# Altium schematic sheet CPU_STM32F4.SchDoc: Thermostat 8CH
size 420 x 297 mm; Author: G.K.; CompanyName: WUT; DrawnBy: G.K.; Organization: WUT ISE; Address1: Warsaw Univeristy of Technology; Address2: Nowowiejska 15/19; DocumentNumber: 3; Revision: -; SheetNumber: 3; SheetTotal: 9; EDA_Number: Sinara; Projet: Thermostat; ModifiedBy: -; CreateDate: XX/XX/XXXX; CheckedDate: -; Title2: STM32 CPU; DivGrp: ISE; Designer: G.K.; ModifiedDate: -; ProjectName: Booster RF Power Amplifier
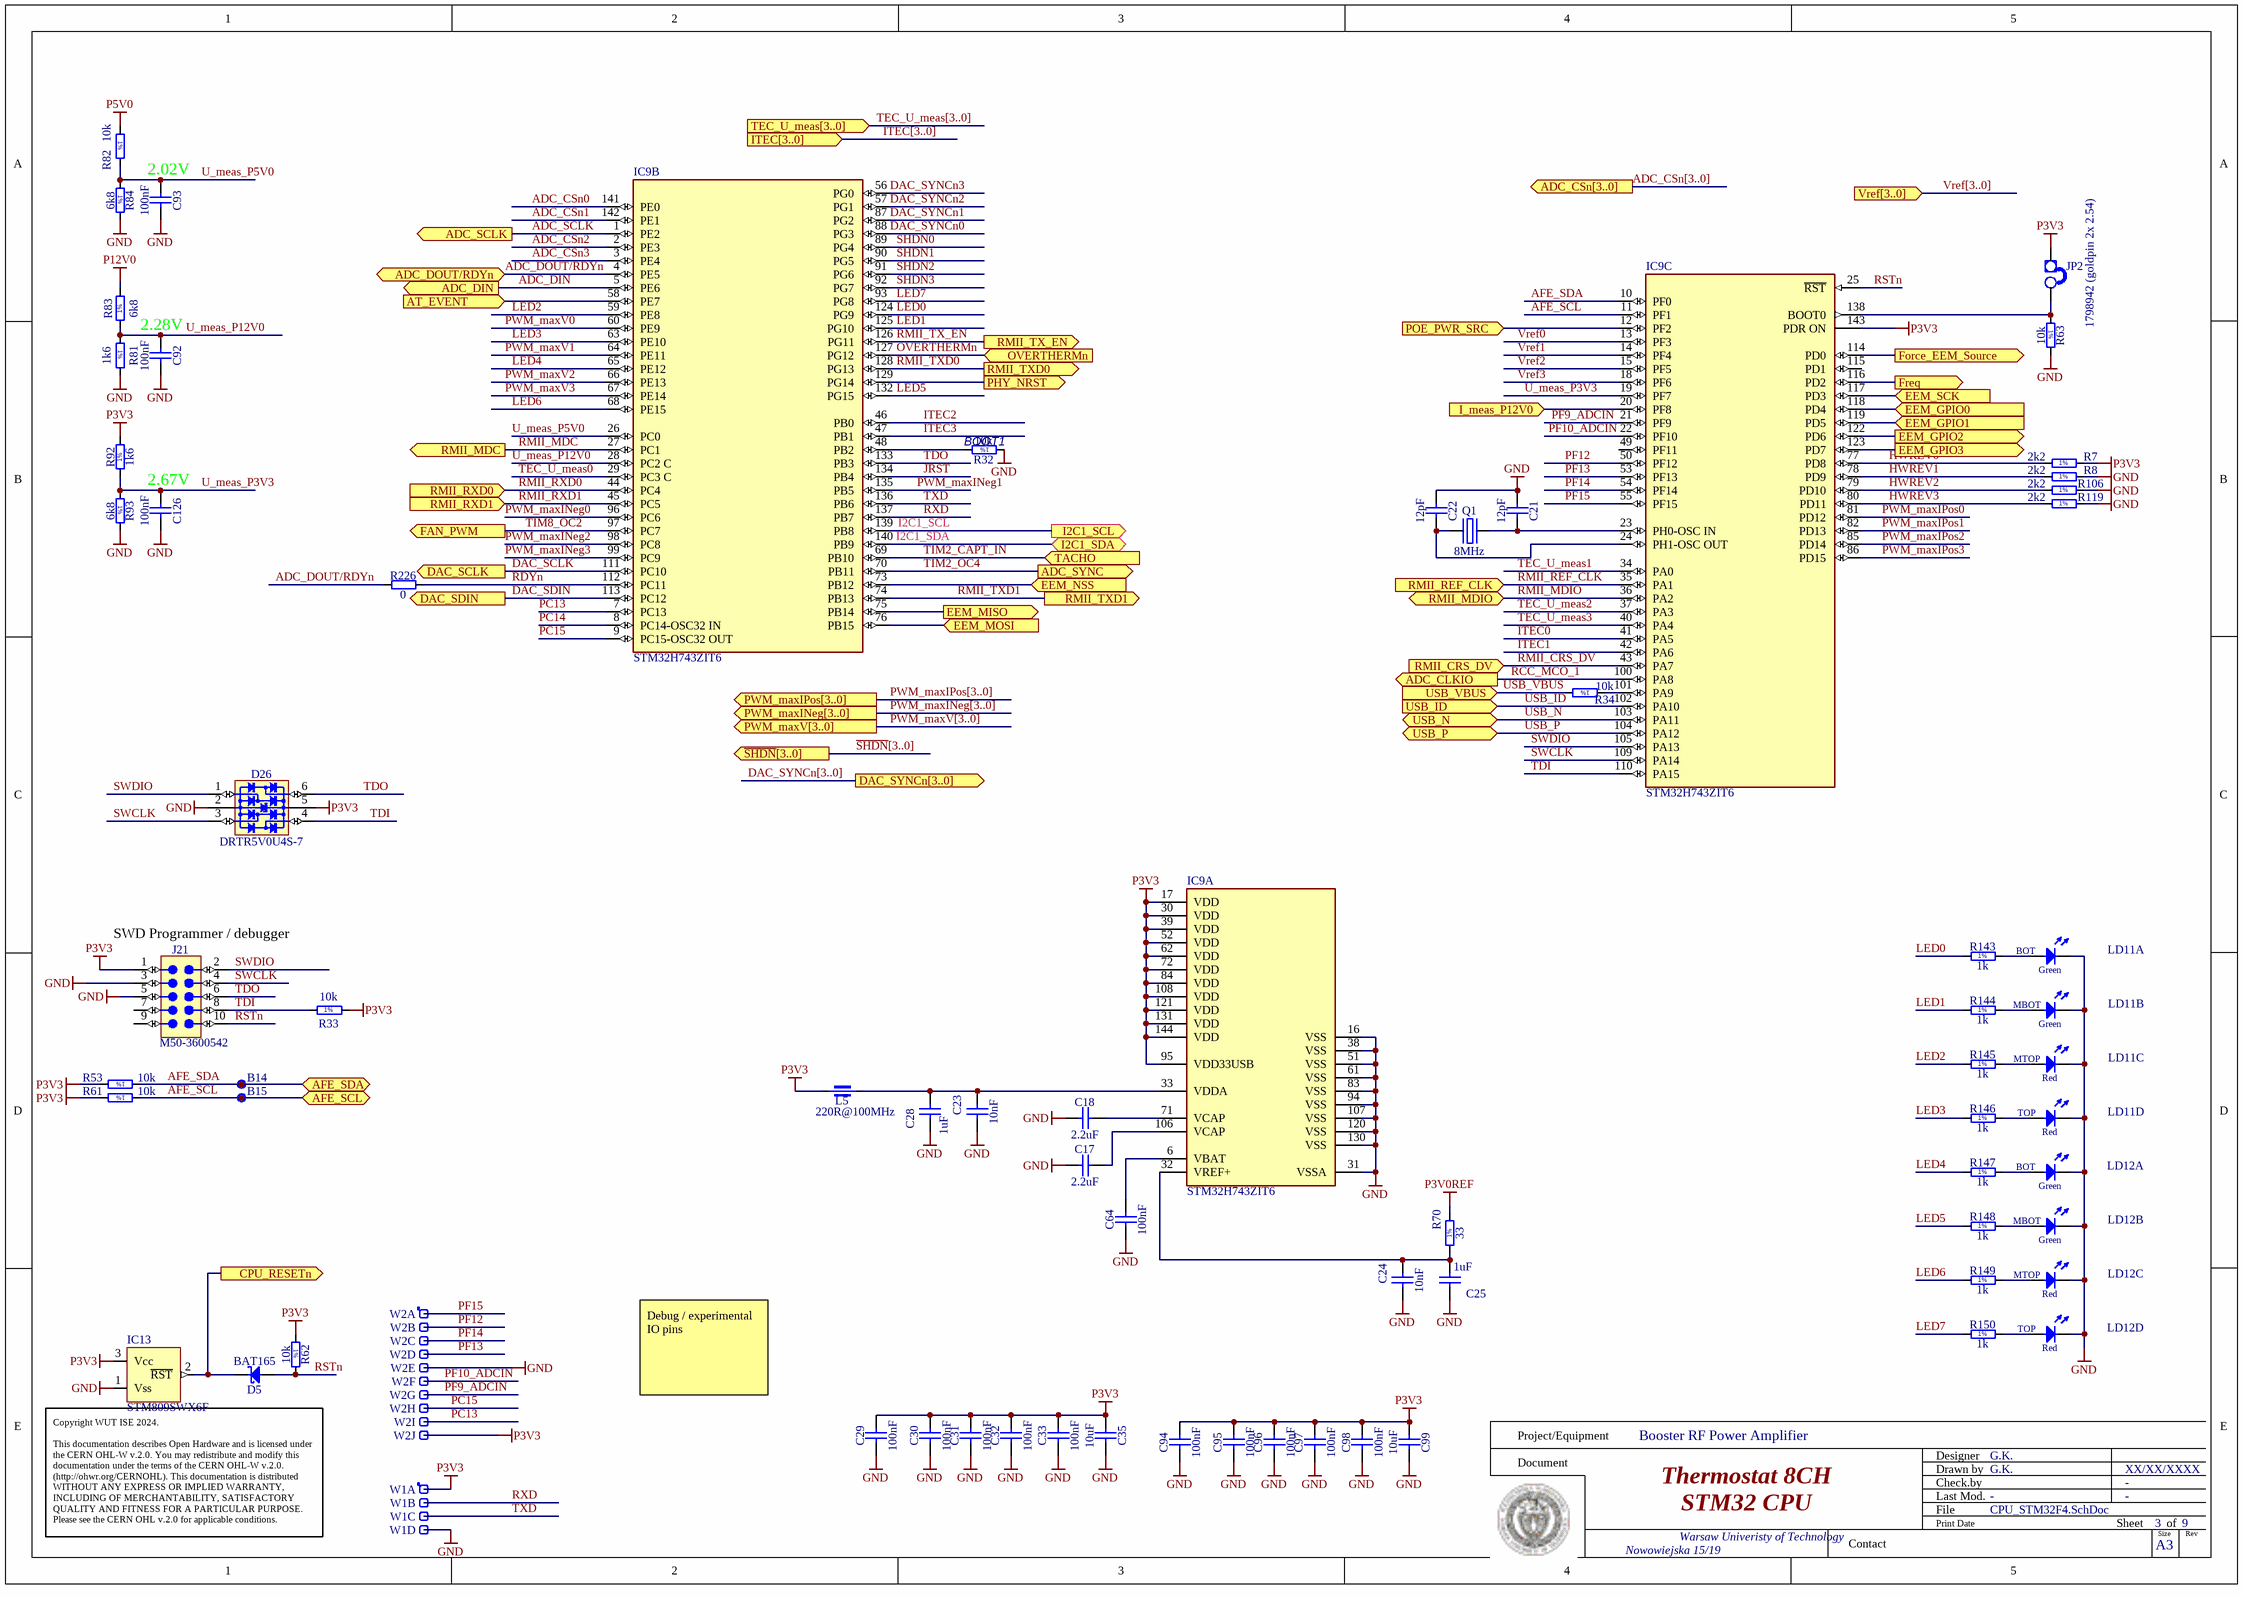
[diagram p0: CPU_STM32F4.SchDoc]

## Parts
B14  SMD Pad  [C100]  (value not drawn)
B15  SMD Pad  [C100]  (value not drawn)
C17  2.2uF  [CAPC1608X90N]
C18  2.2uF  [CAPC1608X90N]
C21  12pF  [CAPC1005X55N]
C22  12pF  [CAPC1005X55N]
C23  10nF  [CAPC1005X55N]
C24  10nF  [CAPC1005X55N]
C25  1uF  [CAPC1608X87N]
C28  1uF  [CAPC1608X87N]
C29  100nF  [CAPC1005X55N]
C30  100nF  [CAPC1005X55N]
C31  100nF  [CAPC1005X55N]
C32  100nF  [CAPC1005X55N]
C33  100nF  [CAPC1005X55N]
C35  10uF  [CAPC2012X135N]
C64  100nF  [CAPC1005X55N]
C92  100nF  [CAPC1005X55N]
C93  100nF  [CAPC1005X55N]
C94  100nF  [CAPC1005X55N]
C95  100nF  [CAPC1005X55N]
C96  100nF  [CAPC1005X55N]
C97  100nF  [CAPC1005X55N]
C98  100nF  [CAPC1005X55N]
C99  10uF  [CAPC2012X135N]
C126  100nF  [CAPC1005X55N]
D5  BAT165  [SOD2512X110N]
D26  DRTR5V0U4S-7  [SOT65P210X110-6N]
IC9  STM32H743ZIT6  [FP-LQFP144-1A-MFG]  (parts A,B,C of 3)
IC13  STM809SWX6F  [SOT-23]
J21  Manufacturer Part Number: M50-3600542  [HARWIN_M50-3600542]  (hidden comment: Header 10)
JP2  1798942 (goldpin 2x 2.54)  [jump]
L5  220R@100MHz  [INDC1005X55N]
LD11  Green/Green/HeRed/HeRed  [LED_BIVAR_H485CHHGGDL]  (value not drawn)  (parts A,B,C,D of 4)
LD12  Green/Green/HeRed/HeRed  [LED_BIVAR_H485CHHGGDL]  (value not drawn)  (parts A,B,C,D of 4)
Q1  8MHz  [XTAL_TXC_7A]
R7  2k2  [RESC1005X40N]
R8  2k2  [RESC1005X40N]
R32  10k  [RESC1005X40N]
R33  10k  [RESC1005X40N]
R34  10k  [RESC1005X40N]
R53  10k  [RESC1005X40N]
R61  10k  [RESC1005X40N]
R62  10k  [RESC1005X40N]
R63  10k  [RESC1005X40N]
R70  33  [RESC1005X40N]
R81  1k6  [RESC1005X40N]
R82  10k  [RESC1005X40N]
R83  6k8  [RESC1005X40N]
R84  6k8  [RESC1005X40N]
R92  1k6  [RESC1005X40N]
R93  6k8  [RESC1005X40N]
R106  2k2  [RESC1005X40N]
R119  2k2  [RESC1005X40N]
R143  1k  [RESC1005X40N]
R144  1k  [RESC1005X40N]
R145  1k  [RESC1005X40N]
R146  1k  [RESC1005X40N]
R147  1k  [RESC1005X40N]
R148  1k  [RESC1005X40N]
R149  1k  [RESC1005X40N]
R150  1k  [RESC1005X40N]
R226  0  [RESC1005X40N]
W1  Header 4  [SAMTEC_HTSW-104-23-L-S]  (value not drawn)  (parts A,B,C,D of 4)
W2  Header 10  [SAMTEC_MTLW-110-07-L-S-250]  (value not drawn)  (parts A,B,C,D,E,F,G,H,I,J of 10)

## Ports
ADC_CLKIO (out), ADC_CSn[3..0] (out), ADC_DIN (out), ADC_DOUT/RDYn (bidir), ADC_SCLK (out), ADC_SYNC (out), AFE_SCL (bidir), AFE_SDA (bidir), AT_EVENT (in), CPU_RESETn (out), DAC_SCLK (out), DAC_SDIN (out), DAC_SYNCn[3..0] (out), EEM_GPIO0 (in), EEM_GPIO1 (in), EEM_GPIO2 (out), EEM_GPIO3 (out), EEM_MISO (out), EEM_MOSI (in), EEM_NSS (in), EEM_SCK (in), FAN_PWM (out), Force_EEM_Source (out), Freq (out), I2C1_SCL (out), I2C1_SDA (bidir), I_meas_P12V0 (in), ITEC[3..0] (in), OVERTHERMn (in), PHY_NRST (out), POE_PWR_SRC (in), PWM_maxINeg[3..0] (out), PWM_maxIPos[3..0] (out), PWM_maxV[3..0] (out), RMII_CRS_DV (in), RMII_MDC (out), RMII_MDIO (bidir), RMII_REF_CLK (in), RMII_RXD0 (in), RMII_RXD1 (in), RMII_TX_EN (out), RMII_TXD0 (out), RMII_TXD1 (out), TACHO (in), TEC_U_meas[3..0] (in), USB_ID (in), USB_N (bidir), USB_P (bidir), USB_VBUS (in), Vref[3..0] (in), ~{SHDN}[3..0] (out)

## Nets
GND: C17.1 C18.1 C21.2 C22.2 C23.1 C24.1 C25.1 C28.1 C29.1 C30.1 C31.1 C32.1 C33.1 C35.2 C64.1 C92.2 C93.2 C94.1 C95.1 C96.1 C97.1 C98.1 C99.2 C126.2 D26.2(GND) IC9.16(VSS) IC9.31(VSSA) IC9.38(VSS) IC9.51(VSS) IC9.61(VSS) IC9.83(VSS) IC9.94(VSS) IC9.107(VSS) IC9.120(VSS) IC9.130(VSS) IC13.1(Vss) J21.3 J21.5 LD11.1(C) LD11.3(C) LD11.5(C) LD11.7(C) LD12.1(C) LD12.3(C) LD12.5(C) LD12.7(C) R8.2 R32.1 R63.2 R81.2 R84.2 R93.2 R106.2 R119.2 W1.4 W2.5
P3V0REF: R70.2
P3V3: C29.2 C30.2 C31.2 C32.2 C33.2 C35.1 C94.2 C95.2 C96.2 C97.2 C98.2 C99.1 D26.5(VBUS) IC9.17(VDD) IC9.30(VDD) IC9.39(VDD) IC9.52(VDD) IC9.62(VDD) IC9.72(VDD) IC9.84(VDD) IC9.95(VDD33USB) IC9.108(VDD) IC9.121(VDD) IC9.131(VDD) IC9.143(PDR_ON) IC9.144(VDD) IC13.3(Vcc) J21.1 JP2.1(E1) L5.2 R7.2 R33.2 R53.2 R61.2 R62.1 R92.2 W1.1 W2.10
P5V0: R82.1
P12V0: R83.2
~{SHDN}0: IC9.89(PG4)
~{SHDN}1: IC9.90(PG5)
~{SHDN}2: IC9.91(PG6)
~{SHDN}3: IC9.92(PG7)
ADC_CSn0: IC9.141(PE0)
ADC_CSn1: IC9.142(PE1)
ADC_CSn2: IC9.2(PE3)
ADC_CSn3: IC9.3(PE4)
ADC_DIN: IC9.5(PE6) ; port ADC_DIN
ADC_DOUT/RDYn: IC9.4(PE5) R226.1 ; port ADC_DOUT/RDYn
ADC_SCLK: IC9.1(PE2) ; port ADC_SCLK
AFE_SCL: B15.1 IC9.11(PF1) R61.1 ; port AFE_SCL
AFE_SDA: B14.1 IC9.10(PF0) R53.1 ; port AFE_SDA
AT_EVENT: IC9.58(PE7) ; port AT_EVENT
CPU_RESETn: D5.1(C) IC13.2(~{RST}) ; port CPU_RESETn
DAC_SCLK: IC9.111(PC10) ; port DAC_SCLK
DAC_SDIN: IC9.113(PC12) ; port DAC_SDIN
DAC_SYNCn0: IC9.88(PG3)
DAC_SYNCn1: IC9.87(PG2)
DAC_SYNCn2: IC9.57(PG1)
DAC_SYNCn3: IC9.56(PG0)
EEM_GPIO0: IC9.118(PD4) ; port EEM_GPIO0
EEM_GPIO1: IC9.119(PD5) ; port EEM_GPIO1
EEM_GPIO2: IC9.122(PD6) ; port EEM_GPIO2
EEM_GPIO3: IC9.123(PD7) ; port EEM_GPIO3
EEM_MISO: IC9.75(PB14) ; port EEM_MISO
EEM_MOSI: IC9.76(PB15) ; port EEM_MOSI
EEM_NSS: IC9.73(PB12) ; port EEM_NSS
EEM_SCK: IC9.117(PD3) ; port EEM_SCK
Force_EEM_Source: IC9.114(PD0) ; port Force_EEM_Source
Freq: IC9.116(PD2) ; port Freq
HWREV0: IC9.77(PD8) R7.1
HWREV1: IC9.78(PD9) R8.1
HWREV2: IC9.79(PD10) R106.1
HWREV3: IC9.80(PD11) R119.1
I2C1_SCL: IC9.139(PB8) ; port I2C1_SCL
I2C1_SDA: IC9.140(PB9) ; port I2C1_SDA
I_meas_P12V0: IC9.20(PF8) ; port I_meas_P12V0
ITEC0: IC9.41(PA5)
ITEC1: IC9.42(PA6)
ITEC2: IC9.46(PB0)
ITEC3: IC9.47(PB1)
JRST: IC9.134(PB4)
LED0: IC9.124(PG9) R143.1
LED1: IC9.125(PG10) R144.1
LED2: IC9.59(PE8) R145.1
LED3: IC9.63(PE10) R146.1
LED4: IC9.65(PE12) R147.1
LED5: IC9.132(PG15) R148.1
LED6: IC9.68(PE15) R149.1
LED7: IC9.93(PG8) R150.1
OVERTHERMn: IC9.127(PG12) ; port OVERTHERMn
PC13: IC9.7(PC13) W2.9
PC14: IC9.8(PC14-OSC32_IN)
PC15: IC9.9(PC15-OSC32_OUT) W2.8
PF9_ADCIN: IC9.21(PF9) W2.7
PF10_ADCIN: IC9.22(PF10) W2.6
PF12: IC9.50(PF12) W2.2
PF13: IC9.53(PF13) W2.4
PF14: IC9.54(PF14) W2.3
PF15: IC9.55(PF15) W2.1
PHY_NRST: IC9.129(PG14) ; port PHY_NRST
POE_PWR_SRC: IC9.12(PF2) ; port POE_PWR_SRC
PWM_maxINeg0: IC9.96(PC6)
PWM_maxINeg1: IC9.135(PB5)
PWM_maxINeg2: IC9.98(PC8)
PWM_maxINeg3: IC9.99(PC9)
PWM_maxIPos0: IC9.81(PD12)
PWM_maxIPos1: IC9.82(PD13)
PWM_maxIPos2: IC9.85(PD14)
PWM_maxIPos3: IC9.86(PD15)
PWM_maxV0: IC9.60(PE9)
PWM_maxV1: IC9.64(PE11)
PWM_maxV2: IC9.66(PE13)
PWM_maxV3: IC9.67(PE14)
RCC_MCO_1: IC9.100(PA8) ; port ADC_CLKIO
RDYn: IC9.112(PC11) R226.2
RMII_CRS_DV: IC9.43(PA7) ; port RMII_CRS_DV
RMII_MDC: IC9.27(PC1) ; port RMII_MDC
RMII_MDIO: IC9.36(PA2) ; port RMII_MDIO
RMII_REF_CLK: IC9.35(PA1) ; port RMII_REF_CLK
RMII_RXD0: IC9.44(PC4) ; port RMII_RXD0
RMII_RXD1: IC9.45(PC5) ; port RMII_RXD1
RMII_TX_EN: IC9.126(PG11) ; port RMII_TX_EN
RMII_TXD0: IC9.128(PG13) ; port RMII_TXD0
RMII_TXD1: IC9.74(PB13) ; port RMII_TXD1
RSTn: D5.2(A) IC9.25(~{RST}) J21.10 R62.2
RXD: IC9.137(PB7) W1.2
SWCLK: D26.3(I/O2) IC9.109(PA14) J21.4
SWDIO: D26.1(I/O1) IC9.105(PA13) J21.2
TDI: D26.4(I/O3) IC9.110(PA15) J21.8 R33.1
TDO: D26.6(I/O4) IC9.133(PB3) J21.6
TEC_U_meas0: IC9.29(PC3_C)
TEC_U_meas1: IC9.34(PA0)
TEC_U_meas2: IC9.37(PA3)
TEC_U_meas3: IC9.40(PA4)
TIM2_CAPT_IN: IC9.69(PB10) ; port TACHO
TIM2_OC4: IC9.70(PB11) ; port ADC_SYNC
TIM8_OC2: IC9.97(PC7) ; port FAN_PWM
TXD: IC9.136(PB6) W1.3
U_meas_P3V3: C126.1 IC9.19(PF7) R92.1 R93.1
U_meas_P5V0: C93.1 IC9.26(PC0) R82.2 R84.1
U_meas_P12V0: C92.1 IC9.28(PC2_C) R81.1 R83.1
USB_ID: IC9.102(PA10) ; port USB_ID
USB_N: IC9.103(PA11) ; port USB_N
USB_P: IC9.104(PA12) ; port USB_P
USB_VBUS: R34.2 ; port USB_VBUS
Vref0: IC9.13(PF3)
Vref1: IC9.14(PF4)
Vref2: IC9.15(PF5)
Vref3: IC9.18(PF6)
NetC17_2: C17.2 IC9.106(VCAP)
NetC18_2: C18.2 IC9.71(VCAP)
NetC21_1: C21.1 IC9.23(PH0-OSC_IN) Q1.1(OSC1)
NetC22_1: C22.1 IC9.24(PH1-OSC_OUT) Q1.2(OSC2)
NetC23_2: C23.2 C28.2 IC9.33(VDDA) L5.1
NetC24_2: C24.2 C25.2 IC9.32(VREF+) R70.1
NetC64_2: C64.2 IC9.6(VBAT)
NetIC9_48: IC9.48(PB2) R32.2
NetIC9_101: IC9.101(PA9) R34.1
NetIC9_138: IC9.138(BOOT0) JP2.2(E2) R63.1
NetLD11_2: LD11.2(A) R143.2
NetLD11_4: LD11.4(A) R144.2
NetLD11_6: LD11.6(A) R145.2
NetLD11_8: LD11.8(A) R146.2
NetLD12_2: LD12.2(A) R147.2
NetLD12_4: LD12.4(A) R148.2
NetLD12_6: LD12.6(A) R149.2
NetLD12_8: LD12.8(A) R150.2

Not connected (* = marked no-connect by the designer): IC9 49(PF11) 115(PD1); J21 7 9

## Buses and harness runs
bus ADC_CSn[3..0] = port ADC_CSn[3..0]
bus DAC_SYNCn[3..0] = port DAC_SYNCn[3..0]
bus ITEC[3..0] = port ITEC[3..0]
bus PWM_maxINeg[3..0] = port PWM_maxINeg[3..0]
bus PWM_maxIPos[3..0] = port PWM_maxIPos[3..0]
bus PWM_maxV[3..0] = port PWM_maxV[3..0]
bus TEC_U_meas[3..0] = port TEC_U_meas[3..0]
bus Vref[3..0] = port Vref[3..0]
bus ~{SHDN}[3..0] = port ~{SHDN}[3..0]

## Notes on the sheet
- (near C93) 2.02V
- 2.28V
- (near R32) BOOT1
- (near C126) 2.67V
- (near J21) SWD Programmer / debugger
- Debug / experimental IO pins
- Project/Equipment
- Document
- Designer
- Drawn by
- Check.by
- Copyright WUT ISE 2024.
  This documentation describes Open Hardware and is licensed under the CERN OHL-W v.2.0. You may redistribute and modify this documentation under the terms of the CERN OHL-W v.2.0. (http://ohwr.org/CERNOHL). This documentation is distributed WITHOUT ANY EXPRESS OR IMPLIED WARRANTY, INCLUDING OF MERCHANTABILITY, SATISFACTORY QUALITY AND FITNESS FOR A PARTICULAR PURPOSE. Please see the CERN OHL v.2.0 for applicable conditions.
- Contact
- File
- Last Mod.
- Print Date
- Sheet
- Size
- A3
- of
- Rev
- (in symbol LED_BIVAR_H485CHHGGDL, part A) BOT; Green
- (in symbol LED_BIVAR_H485CHHGGDL, part B) MBOT; Green
- (in symbol LED_BIVAR_H485CHHGGDL, part C) MTOP; Red
- (in symbol LED_BIVAR_H485CHHGGDL, part D) TOP; Red
- (in symbol R0402_1K6_1%_0.0625W_100PPM) 1%
- (in symbol R0402_1K_1%_0.0625W_100PPM) 1%
- (in symbol R0402_2K2_1%_0.0625W_100PPM) 1%
- (in symbol R0402_6K8_1%_0.0625W_100PPM) 1%
- (in symbol R0402_10K_1%_0.0625W_100PPM) 1%
- (in symbol R0402_33R_1%_0.0625W_100PPM) 1%

## Library data of the parts
B14 B15 = SMD_PAD_D1MM: Through Hole Pad; Part Description: 1mm Diameter SMD Pad; Mounted: No; Part Number: SMD_PAD_D1MM; Component Kind: Standard (No BOM); Component Type: Standard (No BOM); Pin Count: 1; Family: SMD Pad; Socket: No; SMD: No; Sense: No; Status: None; ComponentHeight: 0mm; HelpURL: Undefined; Author: CERN DEM JLC; CreateDate: 10.10.2017; LatestRevisionDate: 10.10.2017; PackageDescription: 1mm Diameter SMD Pad
C17 C18 = CC0603_2.2UF_10V_20%_X7R: Non-polarised capacitor; Part Description: SMD Multilayer Chip Ceramic Capacitor; Manufacturer: GENERIC; Manufacturer1 Part Number: LMK107B7225MA-T; Voltage: 10V; TC: X7R; Tolerance: ±20%; Part Number: CC0603_2.2UF_10V_20%_X7R; Component Kind: Standard; Component Type: Standard; Pin Count: 2; Value: 2.2uF; Status: Not Recommended; Manufacturer Part Number: CC0603_2.2UF_10V_20%_X7R; Case: 0603; Mounted: Yes; Socket: No; SMD: Yes; Sense: No; Manufacturer1 Example: TAIYO YUDEN; Manufacturer1 ComponentHeight: 0.9mm; HelpURL: \\cern.ch\dfs\Applications\Altium\Datasheets\CC0603_X7R_TAIYO-YUDEN_HIGH-VALUE.pdf; Author: CERN DEM JLC; CreateDate: 22.06.2011; LatestRevisionDate: 27.06.2011
C21 C22 = CC0402_12PF_50V_5%_C0G: Non-polarised capacitor; Part Description: SMD Multilayer Chip Ceramic Capacitor; Manufacturer: GENERIC; Manufacturer1 Part Number: C0402C120J5GACTU; Voltage: 50V; TC: C0G/NP0; Tolerance: ±5%; Part Number: CC0402_12PF_50V_5%_C0G; Component Kind: Standard; Component Type: Standard; Pin Count: 2; Value: 12pF; Status: Preferred; Manufacturer Part Number: CC0402_12PF_50V_5%_C0G; Case: 0402; Mounted: Yes; Socket: No; SMD: Yes; Sense: No; Manufacturer1 Example: KEMET; Manufacturer1 ComponentHeight: 0.55mm; HelpURL: \\cern.ch\dfs\Applications\Altium\Datasheets\CC0805_C0G_KEMET_(Commercial Grade).pdf; Author: CERN DEM JLC; CreateDate: 04.10.2016; LatestRevisionDate: 04.10.2016
C23 C24 = CC0402_10NF_25V_10%_X7R: Non-polarised capacitor; Part Description: SMD Multilayer Chip Ceramic Capacitor; Manufacturer: GENERIC; Manufacturer1 Part Number: C1005X7R1E103KT; Voltage: 25V; TC: X7R; Tolerance: ±10%; Part Number: CC0402_10NF_25V_10%_X7R; Component Kind: Standard; Component Type: Standard; Pin Count: 2; Value: 10nF; Status: Preferred; Manufacturer Part Number: CC0402_10NF_25V_10%_X7R; Case: 0402; Mounted: Yes; Socket: No; SMD: Yes; Sense: No; Manufacturer1 Example: TDK; Manufacturer1 ComponentHeight: 0.55mm; HelpURL: \\cern.ch\dfs\Applications\Altium\Datasheets\CC0402_X7R_TDK_C.pdf; Author: CERN DEM JLC; CreateDate: 25/10/2012; LatestRevisionDate: 25/10/2012
C25 C28 = CC0603_1UF_25V_10%_X7R: Non-polarised capacitor; Part Description: SMD Multilayer Chip Ceramic Capacitor; Manufacturer: GENERIC; Manufacturer1 Part Number: GRM188R71E105KA12D; Voltage: 25V; TC: X7R; Tolerance: ±10%; Part Number: CC0603_1UF_25V_10%_X7R; Component Kind: Standard; Component Type: Standard; Pin Count: 2; Value: 1uF; Status: None; Manufacturer Part Number: CC0603_1UF_25V_10%_X7R; Case: 0603; Mounted: Yes; Socket: No; SMD: Yes; Sense: No; Manufacturer1 Example: MURATA; Manufacturer1 ComponentHeight: 0.9mm; HelpURL: \\cern.ch\dfs\Applications\Altium\Datasheets\CC0603_X7R_MURATA.pdf; Author: CERN DEM JLC; CreateDate: 18/01/2011; LatestRevisionDate: 18/01/2011
C29-C33 C64 C94-C98 = CC0402_100NF_16V_10%_X5R: Non-polarised capacitor; Part Description: SMD Multilayer Chip Ceramic Capacitor; Manufacturer: GENERIC; Manufacturer1 Part Number: GRM155R61C104KA88D; Voltage: 16V; TC: X5R; Tolerance: ±10%; Part Number: CC0402_100NF_16V_10%_X5R; Component Kind: Standard; Component Type: Standard; Pin Count: 2; Value: 100nF; Status: None; Manufacturer Part Number: CC0402_100NF_16V_10%_X5R; Case: 0402; Mounted: Yes; Socket: No; SMD: Yes; Sense: No; Manufacturer1 Example: MURATA; Manufacturer1 ComponentHeight: 0.55mm; HelpURL: \\cern.ch\dfs\Applications\Altium\Datasheets\CC0402_X5R_MURATA_GRM.pdf; Author: CERN DEM JLC; CreateDate: 10.12.2013; LatestRevisionDate: 10.12.2013
C35 C99 = CC0805_10UF_16V_10%_X5R: Non-polarised capacitor; Part Description: SMD Multilayer Chip Ceramic Capacitor; Manufacturer: GENERIC; Manufacturer1 Part Number: C0805C106K4PAC; Voltage: 16V; TC: X5R; Tolerance: ±10%; Part Number: CC0805_10UF_16V_10%_X5R; Component Kind: Standard; Component Type: Standard; Pin Count: 2; Value: 10uF; Status: Preferred; Manufacturer Part Number: CC0805_10UF_16V_10%_X5R; Case: 0805; Mounted: Yes; Socket: No; SMD: Yes; Manufacturer1 Example: KEMET; Manufacturer1 ComponentHeight: 1.4mm; HelpURL: \\cern.ch\dfs\Applications\Altium\Datasheets\CC1206_X5R_KEMET.pdf; Author: CERN DEM JLC; CreateDate: 03.12.2007; LatestRevisionDate: 03.12.2007; Sense: No
C92 C93 C126 = CC0402_100NF_16V_10%_X5R: Non-polarised capacitor; Part Description: SMD Multilayer Chip Ceramic Capacitor; Manufacturer: GENERIC; Manufacturer1 Part Number: GRM155R61C104KA88D; Voltage: 16V; TC: X5R; Tolerance: ±10%; Table: Capacitors SMD; Part Number: CC0402_100NF_16V_10%_X5R; Component Kind: Standard; Component Type: Standard; Pin Count: 2; Value: 100nF; Status: None; Manufacturer Part Number: CC0402_100NF_16V_10%_X5R; Case: 0402; Mounted: Yes; Socket: No; SMD: Yes; Manufacturer1 Example: MURATA; Manufacturer1 ComponentHeight: 0.55mm; HelpURL: \\cern.ch\dfs\Applications\Altium\Datasheets\CC0402_X5R_MURATA_GRM.pdf; Author: CERN DEM JLC; CreateDate: 2013-12-10; LatestRevisionDate: 2013-12-10
D5 = BAT165: Schottky Diode; Part Description: Medium Power AF Schottky Diode; Manufacturer: INFINEON; Voltage: 40V; Power: 750mA; PressFit: No; Bonding: No; Part Number: BAT165; Component Kind: Standard; Component Type: Standard; Device: BAT165; PackageDescription: Small Outline Diode Flat Lead (SOD-323), 1.70mm W X 1.25mm L X 1.10mm H body,  IPC Medium Density; Manufacturer Part Number: BAT165; Pin Count: 2; Case: SOD323; Mounted: Yes; Socket: No; SMD: Yes; Sense: No; ComponentHeight: 1.1mm; HelpURL: \\cern.ch\dfs\Applications\Altium\Datasheets\BAT165.pdf; Author: CERN DEM JLC; CreateDate: 12.11.2014; LatestRevisionDate: 12.11.2014
D26 = D_TVS_DRTR5V0U4S-7: Integrated Quad Ultra-Low Capacitance ESD Protection; Part Description: Integrated Quad Ultra-Low Capacitance ESD (±8kV) Protection; Manufacturer: DIODES; PressFit: No; Bonding: No; Status Comment: Active; Part Number: DRTR5V0U4S-7; Component Kind: Standard; Component Type: Standard; Device: DRTR5V0U4S-7; PackageDescription: SOT363, SC70-6, 0.65mm Pitch; 6 Pin, 1.25mm W X 2.00mm L X 1.10mm H body, IPC Medium Density; Status: Active; Manufacturer Part Number: DRTR5V0U4S-7; Pin Count: 6; Case: SOT363; Mounted: Yes; Socket: No; SMD: Yes; Sense: No; ComponentHeight: 1.1mm; HelpURL: \\cern.ch\dfs\Applications\Altium\Datasheets\PRTR5V0U4Y.pdf; Author: GK; CreateDate: 24.01.2017; LatestRevisionDate: 14.09.2020
IC9 = CMP-12105-000003-1: IC MCU 32BIT 2MB FLASH 144LQFP; Manufacturer: STMicroelectronics; Number Of I2C Channels: 4; Number Of A/D Converters: 2; Standoff Height: 0.05mm; Interface: I2C,SPI,UART,USART,EBI/EMI,CAN,USB,LIN,IrDA,Other; Max Supply Voltage: 3.6V; Number Of Adc Channels: 36; Ram Size: 1MBytes; Number Of Cores: 1; Frequency: 400MHz; Data Bus Width: 32bits; Core Architecture: ARM Cortex-M7; Memory Size: 2MBytes; Number Of Timers/Counters: 22; Min Supply Voltage: 1.62V; Number Of Spi Channels: 6; Max Junction Temp: +125°C; Number Of I/Os: 114; Digikey Description: IC MCU 32BIT 2MB FLASH 144LQFP; Device Class L2: Embedded Processors and Controllers; Number Of Usb Channels: 2; ComponentLink2Description: Datasheet; Ipc Land Pattern Name: QFP50P2200X2200X160-144; Category: IC; Lead Free: Yes; Temperature Range High: +85°C; Mouser Description: MCU 32-Bit STM32 ARM Cortex M7 RISC 2MB Flash 1.8V/2.5V/3.3V 144-Pin LQFP Tray; RoHS: TRUE; Ambient Temperature Range Low: -40°C; Temperature Range Low: -40°C; ComponentLink2URL: https://www.st.com/resource/en/datasheet/stm32h743zi.pdf; Ambient Temperature Range High: +85°C; Octopart: https://octopart.com/stm32h743zit6-stmicroelectronics-76372529; Number Of Pwm Channels: 2; Height: 1.6mm; Manufacturer Part Number: STM32H743ZIT6; Device Class L3: Microcontrollers; Device Class L1: Integrated Circuits (ICs); Automotive: No; Memory Type: FLASH; Number Of Uart Channels: 4; Package: LQFP144-1A; Temperature: -40°C to +85°C
IC13 = VMON_STM809: 2.93V  Reset circuit; Manufacturer Part Number: STM809SWX6F
J21 = CON_2x10 1.27 SMT_male_HARWIN: 10 Contacts - Pitch 1.27mm - Dual Row SMT Vertical Pin Header (Post Lead = 3mm, Insulator 1mm); Manufacturer: HARWIN; PressFit: No; Part Number: HARWIN_M50-3600542; Component Kind: Standard; Component Type: Standard; Pin Count: 10; Family: Header 10; Mounted: Yes; Socket: No; SMD: Yes; Sense: No; Status: None; Part Description: 10 Contacts - Pitch 1.27mm - Dual Row SMT Vertical Pin Header (Post Lead = 3mm, Insulator 1mm); ComponentHeight: 5.13mm; HelpURL: \\cern.ch\dfs\Applications\Altium\Datasheets\HARWIN_M50-3600842.pdf; Author: GK; CreateDate: 15.03.2017; LatestRevisionDate: 22.05.2017
JP2 = JUMPER: Manufacturer Part Number: 68001-102HLF; Supplier 1: Farnell; Supplier Part Number 1: 1798942
L5 = IND0402_MURATA_BLM15HB221SN1: Part Description: SMD EMIFIL Suppression Chip Ferrite Bead; Manufacturer: MURATA; Power: 250mA; Resistance: 1R; Tolerance: ±25%; Part Number: IND0402_MURATA_BLM15HB221SN1; Component Kind: Standard; Component Type: Standard; Pin Count: 2; Value: 220R@100MHz; Status: None; Manufacturer Part Number: BLM15HB221SN1; Case: 0402; Mounted: Yes; Socket: No; SMD: Yes; Sense: No; ComponentHeight: 0.55mm; HelpURL: \\cern.ch\dfs\Applications\Altium\Datasheets\IND0402_MURATA_BLM15H.pdf; Author: CERN DEM JLC; CreateDate: 23.06.2009; LatestRevisionDate: 25.10.2018
LD11 LD12 = LED_BIVAR_H485CHHGGDL: LED x4 G-1C2A-BOT_G-3C4A_H-5C6A_H-7C8A-TOP; Part Description: Quad-Level 2mm (Green+Green+HeRed+HeRed) LED, PCB Edge Mounting; Manufacturer: BIVAR; PressFit: No; Bonding: No; Part Number: LED_BIVAR_H485CHHGGDL; Component Kind: Standard; Component Type: Standard; Color: Green/Green/HeRed/HeRed; PackageDescription: Quad-Level 2mm (Green+Green+HeRed+HeRed) LED, PCB Edge Mounting  BIVAR H485C Serie; Status: Not Recommended; Manufacturer Part Number: H485CHHGGDL; Pin Count: 8; Mounted: Yes; Socket: No; SMD: No; Sense: No; ComponentHeight: 11.3mm; HelpURL: \\cern.ch\dfs\Applications\Altium\Datasheets\LED_BIVAR_H485C.pdf; Author: CERN DEM BC; CreateDate: 12.11.2015; LatestRevisionDate: 12.11.2015
Q1 = XTAL_8MHZ_TXC_7A-8.000MAAE-T: Quartz Crystal; Part Description: Tolerance: ±30ppm, Stability: ±30ppm, -20°C to +70°C, 12pF, SMD Glass Seam Sealing Crystal, 7A Series; Manufacturer: TXC CORPORATION; PressFit: No; Bonding: No; Part Number: XTAL_8MHZ_TXC_7A-8.000MAAE-T; Component Kind: Standard; Component Type: Standard; PackageDescription: 2 Pins, 3.2x5mm, SMD Glass Seam Sealing Crystal, 7A Serie; Value: 8MHz; Manufacturer Part Number: 7A-8.000MAAE-T; Pin Count: 2; Mounted: Yes; Socket: No; SMD: Yes; Sense: No; ComponentHeight: 1.2mm; HelpURL: \\cern.ch\dfs\Applications\Altium\Datasheets\XTAL_TXC_7A.pdf; Author: CERN DEM JLC; CreateDate: 09.10.2014; LatestRevisionDate: 12.11.2014
R7 R8 R106 R119 = R0402_2K2_1%_0.0625W_100PPM: Resistor - 1%; Part Description: General Purpose Thick Film Chip Resistor; Manufacturer: GENERIC; Manufacturer1 Part Number: 232270672202L; TC: ±100ppm/°C; Part Number: R0402_2K2_1%_0.0625W_100PPM; Component Kind: Standard; Component Type: Standard; Pin Count: 2; Value: 2k2; Status: Not recommended; Power: 0.0625W; Tolerance: ±1%; Manufacturer Part Number: R0402_2K2_1%_0.0625W_100PPM; Case: 0402; Mounted: Yes; Sense: No; Socket: No; SMD: Yes; Manufacturer1 Example: YAGEO PHYCOMP; Manufacturer1 ComponentHeight: 0.4mm; HelpURL: \\cern.ch\dfs\Applications\Altium\Datasheets\R0402_Phycomp_RC0402.pdf; Author: CERN DEM JLC; CreateDate: 03.12.2007; LatestRevisionDate: 17.10.2012
R32-R34 R53 R61-R63 R82 = R0402_10K_1%_0.0625W_100PPM: Resistor - 1%; Part Description: General Purpose Thick Film Chip Resistor; Manufacturer: GENERIC; Manufacturer1 Part Number: 232270671003L; TC: ±100ppm/°C; Table: Resistors SMD; Part Number: R0402_10K_1%_0.0625W_100PPM; Component Kind: Standard; Component Type: Standard; Pin Count: 2; Value: 10k; Status: Not recommended; Power: 0.0625W; Tolerance: ±1%; Manufacturer Part Number: R0402_10K_1%_0.0625W_100PPM; Case: 0402; Mounted: Yes; Socket: No; SMD: Yes; Manufacturer1 Example: YAGEO PHYCOMP; Manufacturer1 ComponentHeight: 0.4mm; HelpURL: \\cern.ch\dfs\Applications\Altium\Datasheets\R0402_Phycomp_RC0402.pdf; Author: CERN DEM JLC; CreateDate: 2007-12-03; LatestRevisionDate: 2012-10-17
R70 = R0402_33R_1%_0.0625W_100PPM: Resistor - 1%; Part Description: General Purpose Thick Film Chip Resistor; Manufacturer: GENERIC; Manufacturer1 Part Number: 232270673309L; TC: ±100ppm/°C; PressFit: No; Part Number: R0402_33R_1%_0.0625W_100PPM; Component Kind: Standard; Component Type: Standard; Pin Count: 2; Value: 33; Status: Not Recommended; Power: 0.0625W; Tolerance: ±1%; Manufacturer Part Number: R0402_33R_1%_0.0625W_100PPM; Case: 0402; Mounted: Yes; Sense: No; Socket: No; SMD: Yes; Manufacturer1 Example: YAGEO PHYCOMP; Manufacturer1 ComponentHeight: 0.4mm; HelpURL: \\cern.ch\dfs\Applications\Altium\Datasheets\R0402_Phycomp_RC0402.pdf; Author: CERN DEM JLC; CreateDate: 03/12/2007; LatestRevisionDate: 17/10/2012
R81 R92 = R0402_1K6_1%_0.0625W_100PPM: Resistor - 1%; Part Description: General Purpose Thick Film Chip Resistor; Manufacturer: GENERIC; Manufacturer1 Part Number: 232270671602L; TC: ±100ppm/°C; PressFit: No; Part Number: R0402_1K6_1%_0.0625W_100PPM; Component Kind: Standard; Component Type: Standard; Pin Count: 2; Value: 1k6; Status: Not Recommended; Power: 0.0625W; Tolerance: ±1%; Manufacturer Part Number: R0402_1K6_1%_0.0625W_100PPM; Case: 0402; Mounted: Yes; Sense: No; Socket: No; SMD: Yes; Manufacturer1 Example: YAGEO PHYCOMP; Manufacturer1 ComponentHeight: 0.4mm; HelpURL: \\cern.ch\dfs\Applications\Altium\Datasheets\R0402_Phycomp_RC0402.pdf; Author: CERN DEM JLC; CreateDate: 03.12.2007; LatestRevisionDate: 17.10.2012
R83 R84 R93 = R0402_6K8_1%_0.0625W_100PPM: Resistor - 1%; Part Description: General Purpose Thick Film Chip Resistor; Manufacturer: GENERIC; Manufacturer1 Part Number: 232270676802L; TC: ±100ppm/°C; PressFit: No; Part Number: R0402_6K8_1%_0.0625W_100PPM; Component Kind: Standard; Component Type: Standard; Pin Count: 2; Value: 6k8; Status: Not Recommended; Power: 0.0625W; Tolerance: ±1%; Manufacturer Part Number: R0402_6K8_1%_0.0625W_100PPM; Case: 0402; Mounted: Yes; Sense: No; Socket: No; SMD: Yes; Manufacturer1 Example: YAGEO PHYCOMP; Manufacturer1 ComponentHeight: 0.4mm; HelpURL: \\cern.ch\dfs\Applications\Altium\Datasheets\R0402_Phycomp_RC0402.pdf; Author: CERN DEM JLC; CreateDate: 03.12.2007; LatestRevisionDate: 17.10.2012
R143-R150 = R0402_1K_1%_0.0625W_100PPM: Resistor - 1%; Part Description: General Purpose Thick Film Chip Resistor; Manufacturer: GENERIC; Manufacturer1 Part Number: 232270671002L; TC: ±100ppm/°C; PressFit: No; Part Number: R0402_1K_1%_0.0625W_100PPM; Component Kind: Standard; Component Type: Standard; Pin Count: 2; Value: 1k; Status: Not Recommended; Power: 0.0625W; Tolerance: ±1%; Manufacturer Part Number: R0402_1K_1%_0.0625W_100PPM; Case: 0402; Mounted: Yes; Sense: No; Socket: No; SMD: Yes; Manufacturer1 Example: YAGEO PHYCOMP; Manufacturer1 ComponentHeight: 0.4mm; HelpURL: \\cern.ch\dfs\Applications\Altium\Datasheets\R0402_Phycomp_RC0402.pdf; Author: CERN DEM JLC; CreateDate: 03.12.2007; LatestRevisionDate: 17.10.2012
R226 = R0402_0R_JUMPER: Resistor; Part Description: 1A (0.05R Max DC Resistance) Zero Ohm Jumper; Manufacturer: GENERIC; Manufacturer1 Part Number: 232270591001L; PressFit: No; Part Number: R0402_0R_JUMPER; Component Kind: Standard; Component Type: Standard; Pin Count: 2; Value: 0; Status: Not Recommended; Manufacturer Part Number: R0402_0R_JUMPER; Case: 0402; Mounted: Yes; Sense: No; Socket: No; SMD: Yes; Manufacturer1 Example: YAGEO PHYCOMP; Manufacturer1 ComponentHeight: 0.4mm; HelpURL: \\cern.ch\dfs\Applications\Altium\Datasheets\R0402_Phycomp_RC0402.pdf; Author: CERN DEM JLC; CreateDate: 03.12.2007; LatestRevisionDate: 17.10.2012
W1 = SAMTEC_HTSW-104-23-L-S: 4 Mini Wire-Wrap Contact Strip Header; Part Description: 4 Contacts, Pitch 2.54mm, Single Row  Through Mount Straight Header (Post Lead 5.84mm, Tail Lead 2.92mm, Insulator 2.54mm); Manufacturer: SAMTEC; PressFit: No; Status Comment: High Temperature; Part Number: SAMTEC_HTSW-104-23-L-S; Component Kind: Standard; Component Type: Standard; Pin Count: 4; Family: Header 4; Mounted: Yes; Socket: No; Sense: No; SMD: No; Status: Preferred; Manufacturer Part Number: HTSW-104-23-L-S; ComponentHeight: 8.38mm; HelpURL: \\cern.ch\dfs\Applications\Altium\Datasheets\SAMTEC_HTSW-104-23-L-S.pdf; Author: CERN DEM JLC; CreateDate: 22/02/2018; LatestRevisionDate: 22/02/2018
W2 = SAMTEC_MTLW-110-07-L-S-250: 10 Mini Wire-Wrap Contact Strip Header; Part Description: 10 Contacts, Pitch 2.54mm, Single Row Through Mount Straight Header (Post Lead = 6.35mm, Tail Lead 3.05mm, Insulator 1.52mm); Manufacturer: SAMTEC; PressFit: No; Part Number: SAMTEC_MTLW-110-07-L-S-250; Component Kind: Standard; Component Type: Standard; Pin Count: 10; Family: Header 10; Mounted: Yes; Socket: No; Sense: No; SMD: No; Status: None; Manufacturer Part Number: MTLW-110-07-L-S-250; ComponentHeight: 7.87mm; HelpURL: \\cern.ch\dfs\Applications\Altium\Datasheets\SAMTEC_MTLW-110-07-L-S-250.pdf; Author: CERN DEM JLC; CreateDate: 01.11.2017; LatestRevisionDate: 01.11.2017